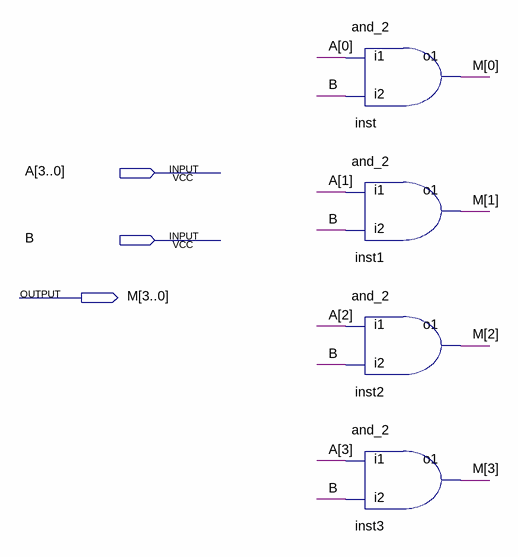
[diagram p0: schematic sheet]
// Quartus schematic MU.bdf as structural Verilog: 4 symbols, 3 pins
module MU (
  input  [3:0] A,
  input  B,
  output [3:0] M
);

  and_2 inst (.i1(A[0]), .i2(B), .o1(M[0]));
  and_2 inst1 (.i1(A[1]), .i2(B), .o1(M[1]));
  and_2 inst2 (.i1(A[2]), .i2(B), .o1(M[2]));
  and_2 inst3 (.i1(A[3]), .i2(B), .o1(M[3]));
endmodule
